# EAGLE design Inverter (EAGLE 8.4.1)
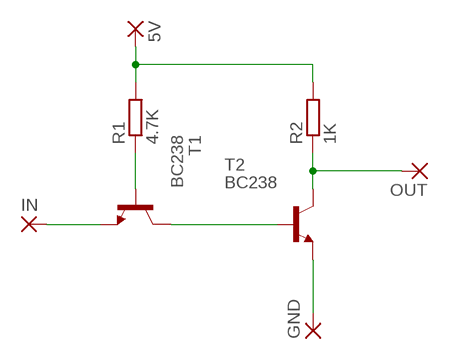
[diagram p0: schematic, sheet 1]

## Parts
5V  2,54/0,8  [2,54/0,8]
GND  2,54/0,8  [2,54/0,8]
IN  2,54/0,8  [2,54/0,8]
OUT  2,54/0,8  [2,54/0,8]
R1  4.7K  R-EU_0204/7  [0204/7]
R2  1K  R-EU_0204/7  [0204/7]
T1  BC238  [TO92]
T2  BC238  [TO92]

## Nets
GND: GND.1(P) T2.1(E)
N$1: IN.1(P) T1.1(E)
N$2: R1.1 T1.2(B)
N$3: T1.3(C) T2.2(B)
N$4: OUT.1(P) R2.1 T2.3(C)
N$6: 5V.1(P) R1.2 R2.2

## Library data of the parts
5V GND IN OUT = wirepad:2,54/0,8: THROUGH-HOLE PAD
R1 R2 = rcl:R-EU_: RESISTOR, European symbol
T1 T2 = transistor:BC238: NPN TRANSISTOR

## Board
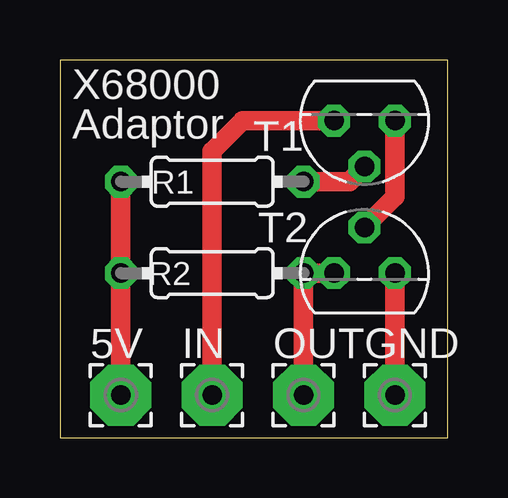
[diagram p1: board, top side]

Size 16.18 x 15.74 mm. Coordinates in mm from the lower left corner, seen from the top.
Outline: 0,0 16.18,0 16.18,15.74 0,15.74 0,0
Copper layers (1*16): Top 0.035mm / dielectric 1.5mm / Bottom 0.035mm
Design rules "default": minimum track width 6mil, minimum drill 0.35mm, track to track 6mil, track to pad 6mil, pad to pad 6mil, via to via 6mil, smd to smd 6mil, copper to edge 40mil, drill to drill 6mil, minimum pad ring 10mil, minimum via ring 8mil, stop-mask expansion 4mil, vias tented up to drill 0mil, thermal gap 10mil

### Footprints (pad centres in the part's own frame; a part is rotated, then mirrored left to right if it is on the bottom)
2,54/0,8 = drill 0.813 pad 2.54 octagon: 1 0,0
0204/7 = drill 0.813 octagon: 1 -3.81,0; 2 3.81,0
TO92 = drill 0.813 octagon: 1 1.27,0; 2 0,1.905; 3 -1.27,0

### Placement (x,y rotation side)
5V  2.54,1.78 0 top
GND  13.97,1.78 0 top
IN  6.35,1.78 0 top
OUT  10.16,1.78 0 top
R1  6.35,10.67 180 top
R2  6.35,6.86 180 top
T1  12.7,13.21 180 top
T2  12.7,6.86 0 top

### Tracks (layer width: path | path; a pad name or v marks a point on that pad's centre or on a via)
GND
  Top 0.813: GND.1 T2.1
N$1
  Top 0.813: T1.1 7.62,13.21 6.35,11.94 IN.1
N$2
  Top 0.813: R1.1 12.06,10.67 T1.2
N$3
  Top 0.813: T1.3 13.97,10.03 T2.2
N$4
  Top 0.813: OUT.1 R2.1 T2.3
N$6
  Top 0.813: 5V.1 R2.2 R1.2

### Text on the board
tPlace: X68000 | Adaptor